# EAGLE design Me-RJ11 Adapter v2.0 (EAGLE 6.2)
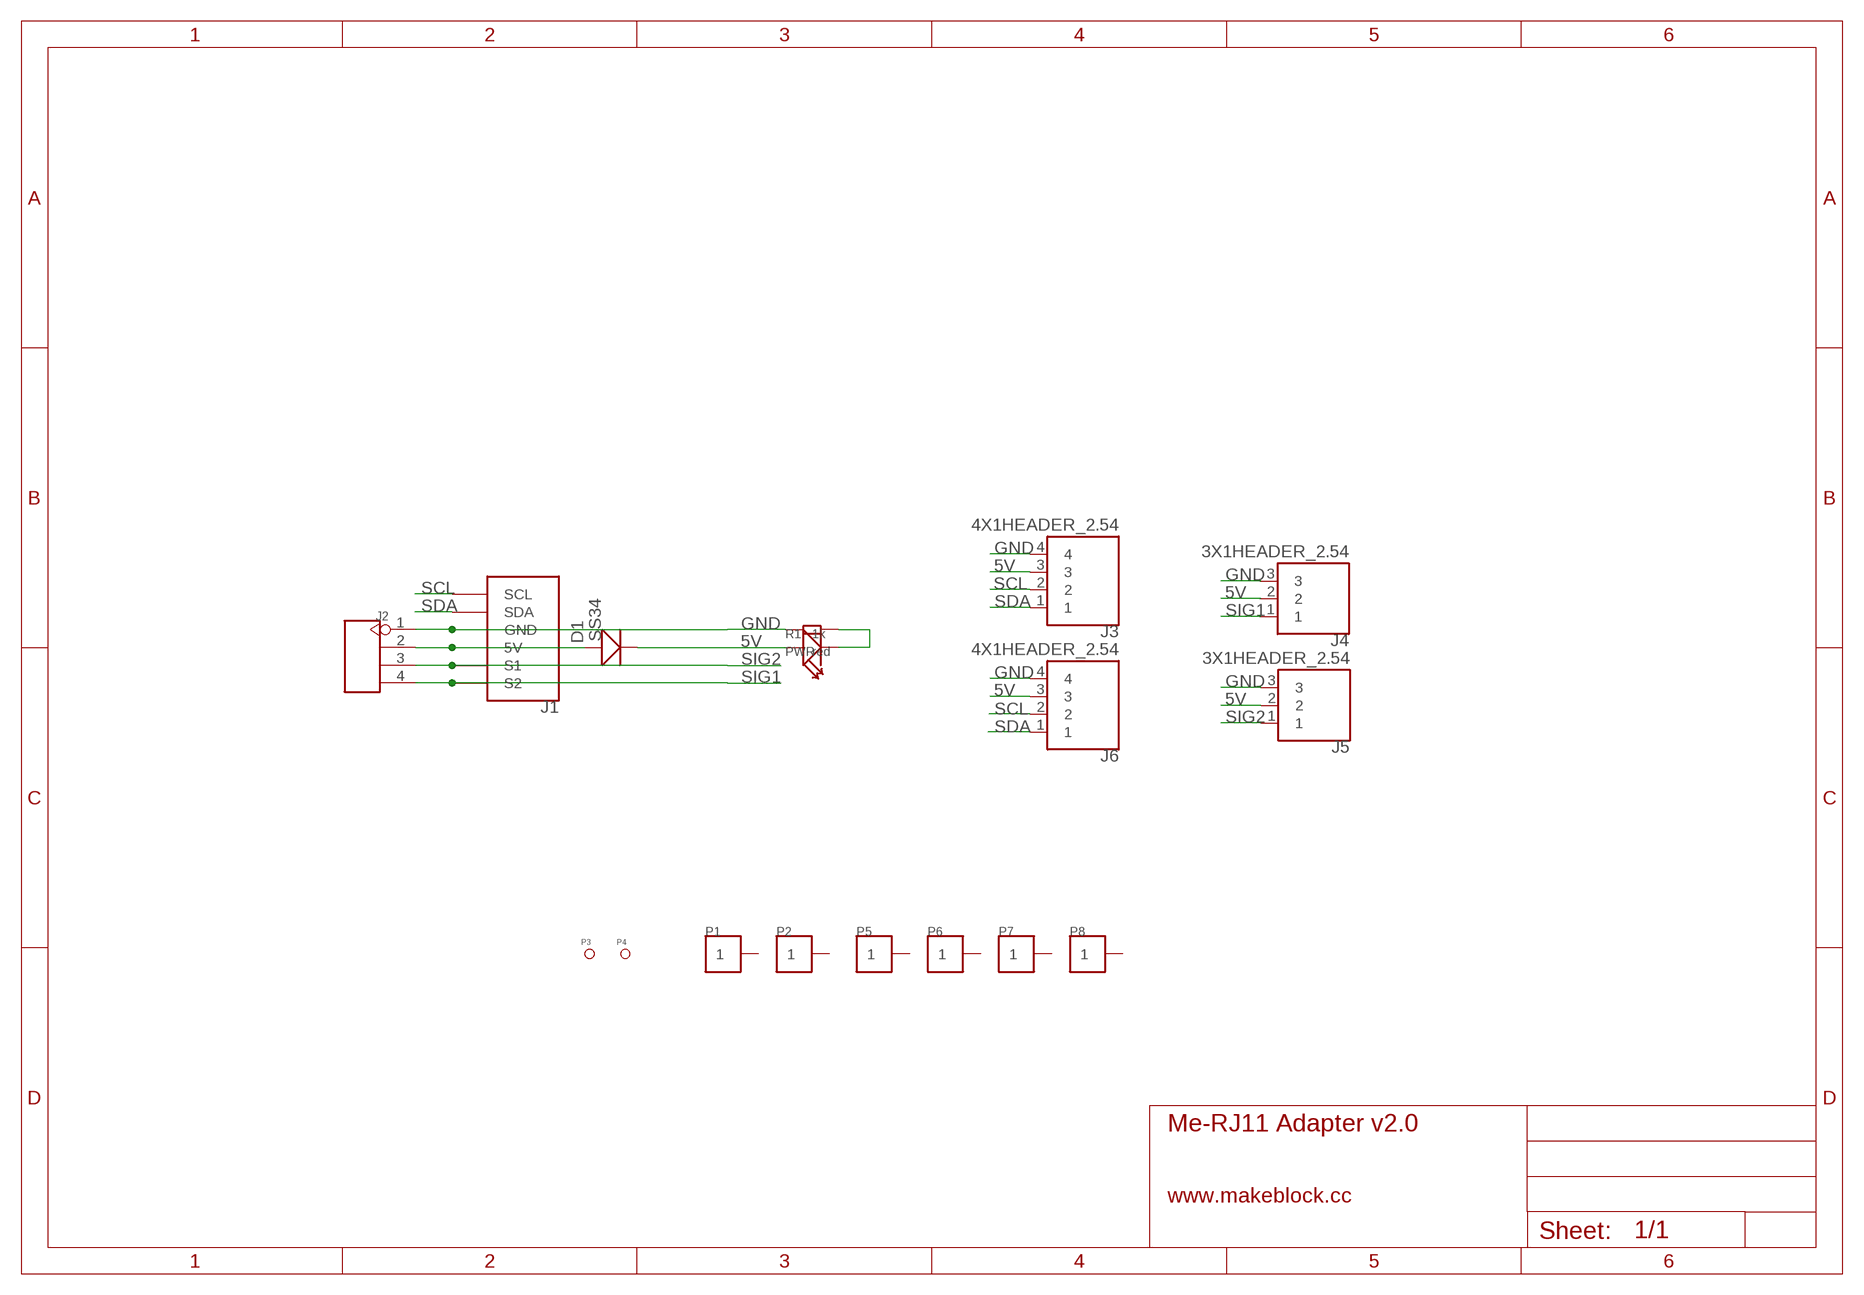
[diagram p0: schematic, sheet 1]

## Parts
D1  SS34  D'SMA'  [D2010]
J1  RJ11-6P6C-DIGI  [RJ11-6P6C]
J2  HEADER-4P-60/35MIL  [4P-65/35MIL]
J3  4X1HEADER_2.54  [4X1HEADER_2.54]
J4  3X1HEADER_2.54  [3X1HEADER_2.54]
J5  3X1HEADER_2.54  [3X1HEADER_2.54]
J6  4X1HEADER_2.54  [4X1HEADER_2.54]
P1  PAD-1P-4MM  [HOLE-01]
P2  PAD-1P-4MM  [HOLE-01]
P3  PAD-MARK  [ROUND-MARK-1.0]
P4  PAD-MARK  [ROUND-MARK-1.0]
P5  PAD-1P-4MM  [HOLE-01]
P6  PAD-1P-4MM  [HOLE-01]
P7  PAD-1P-4MM  [HOLE-01]
P8  PAD-1P-4MM  [HOLE-01]
PWR  red  LED'0603'  [LED-0603]
R1  1k  R-0603  [0603]

## Nets
5V: D1.- J3.3 J4.2 J5.2 J6.3 PWR.+
GND: J1.3(GND) J2.1 J3.4 J4.3 J5.3 J6.4 R1.1
N$1: PWR.- R1.2
N$2: D1.+ J1.4(5V) J2.2
SCL: J1.1(SCL) J3.2 J6.2
SDA: J1.2(SDA) J3.1 J6.1
SIG1: J1.6(S2) J2.4 J4.1
SIG2: J1.5(S1) J2.3 J5.1
Unconnected: P1.1 P2.1 P5.1 P6.1 P7.1 P8.1

## Notes on the sheet
- www.makeblock.cc

## Library data of the parts
D1 = Discrete:D*
J1 = Makeblock:RJ11-6P6C-DIGI
J2 = Connector:HEADER-4P
J3 J6 = Makeblock:4X1HEADER_2.54
J4 J5 = Makeblock:3X1HEADER_2.54
P1 P2 P5-P8 = Makeblock:PAD-1P*
P3 P4 = Discrete:PAD-MARK; PARTNO: DNP
PWR = Discrete:LED*
R1 = Discrete:R*

## Board
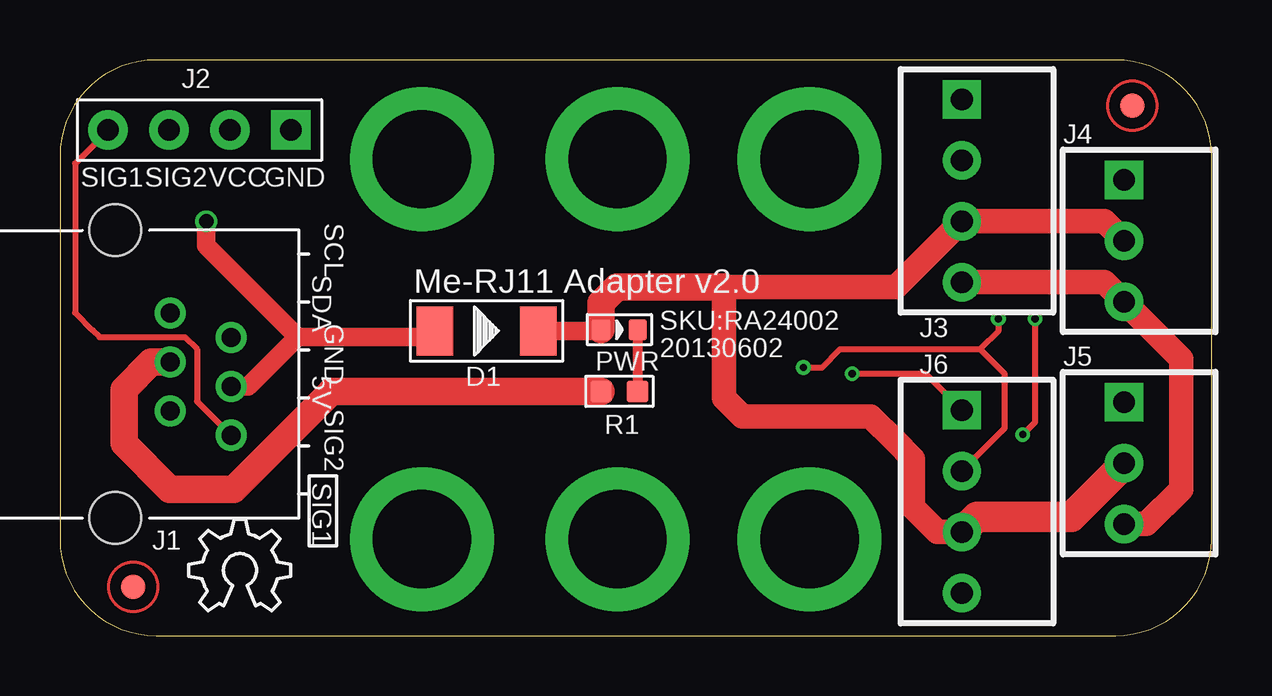
[diagram p1: board, top side]
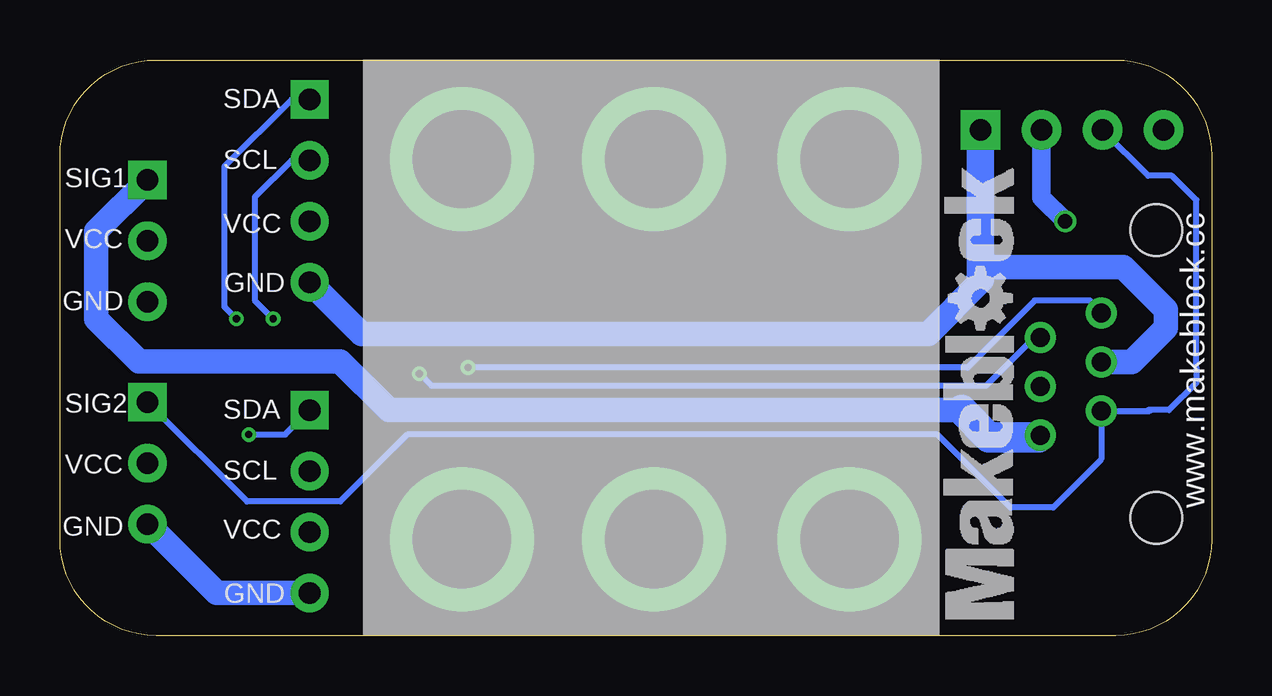
[diagram p2: board, bottom side, seen from below]

Size 48 x 24 mm. Coordinates in mm from the lower left corner, seen from the top.
Outline: 0,20 0,4 arc90 4,0 44,0 arc90 48,4 48,20 arc90 44,24 4,24 arc90 0,20
Copper layers (1*16): Top 0.035mm / dielectric 1.5mm / Bottom 0.035mm
Design rules: minimum track width 6mil, minimum drill 12mil, track to track 8mil, track to pad 8mil, pad to pad 8mil, via to via 8mil, smd to smd 0mil, copper to edge 10mil, drill to drill 10mil, minimum pad ring 10mil, minimum via ring 6mil, stop-mask expansion 2mil, vias tented up to drill 100mil, thermal gap 10mil

### Footprints (pad centres in the part's own frame; a part is rotated, then mirrored left to right if it is on the bottom)
D2010 = smd 1.524 x 2.032: + -2.159,0; - 2.159,0
RJ11-6P6C = drill 0.8: 1 -2.55,1.8; 2 -1.53,4.34; 3 -0.51,1.8; 4 0.51,4.34; 5 1.53,1.8; 6 2.55,4.34 | hole 2.15: -6,-0.5; 6,-0.5
4P-65/35MIL = drill 0.889 pad 1.651 square: 1 0,3.81 | drill 0.889 pad 1.651: 2 0,1.27; 3 0,-1.27; 4 0,-3.81
4X1HEADER_2.54 = drill 0.9 pad 1.6 square: 1 0,0 | drill 0.9 pad 1.6: 2 0,-2.54; 3 0,-5.08; 4 0,-7.62
3X1HEADER_2.54 = drill 0.9 pad 1.6 square: 1 0,2.54 | drill 0.9 pad 1.6: 2 0,0; 3 0,-2.54
HOLE-01 = drill 4.1 pad 6: 1 0,0
ROUND-MARK-1.0 = smd 1.016 x 1.016: P$1 0,0
LED-0603 = smd 0.762 x 0.889: + -0.762,0; - 0.762,0
0603 = smd 0.889 x 0.889: 1 -0.762,0; 2 0.762,0

### Placement (x,y rotation side)
D1  17.78,12.7 0 top
J1  2.79,10.9 270 top
J2  5.82,21.08 270 top
J3  37.59,22.35 0 top
J4  44.35,16.46 0 top
J5  44.35,7.19 0 top
J6  37.59,9.4 0 top
P1  31.24,19.86 0 top
P2  23.24,19.86 0 top
P3  3.05,2.03 0 top
P4  44.7,22.1 0 top
P5  23.24,4.01 0 top
P6  15.09,4.01 0 top
P7  15.09,19.86 0 top
P8  31.24,4.01 0 top
PWR  23.32,12.75 0 top
R1  23.32,10.19 0 top
U$1  [LOGO-3/2]  8.24,0.67 90 bottom
U$2  [OSHW_6X150_NOTEXT]  5.37,1.04 0 top

### Tracks (layer width: path | path; a pad name or v marks a point on that pad's centre or on a via)
5V
  Top 0.762: D1.- 22.5,12.7 PWR.+
  Top 1.016: J4.2 43.54,17.27 J3.3 34.85,14.53 27.69,14.53 27.69,9.91 28.45,9.14 33.78,9.14 34.8,8.13 35.56,7.37 35.56,5.33 35.81,5.08 36.07,4.83 36.58,4.32 J6.3
  Top 1.143: PWR.+ 22.55,13.87 23.22,14.53 27.69,14.53
  Top 1.27: J5.2 44.35,7.14 42.16,4.95 38.23,4.95 J6.3
GND
  Top 0.406: 11.3,10.19 11.28,10.21 10.89,10.21
  Top 1.016: J3.4 43.54,14.73 J4.3 46.74,11.53 46.74,6.1 45.29,4.65 J5.3
  Top 1.143: R1.1 19.41,10.19 11.3,10.19 11.3,10.16 8.64,7.49 7.24,6.1 4.57,6.1 2.67,8 2.67,9.48 2.67,10.26 3.81,11.41 J1.3
  Bottom 1.016: 9.63,14.85 9.63,14.76 11.81,12.57 35.43,12.57 J3.4 | J6.4 41.48,1.78 J5.3 | J1.3 3.33,11.41 1.91,12.83 1.91,13.59 3.68,15.37 9.5,15.37 9.63,15.24
  Bottom 1.143: J2.1 9.63,15.24 9.63,14.85
N$1
  Top 0.406: PWR.- R1.2
N$2  (via drill 0.6)
  Top 0.762: v6.1,17.27 6.1,16.26 9.91,12.45 | 9.91,12.45 15.37,12.45 D1.+ | J1.4 7.85,10.39 9.91,12.45
  Bottom 0.762: J2.2 7.09,18.26 v6.1,17.27
SCL  (via drill 0.3 pad 0.61)
  Top 0.254: v30.99,11.18 31.75,11.18 32.51,11.94 38.35,11.94 | 38.35,11.94 39.37,10.92 39.37,8.64 J6.2 | v39.12,13.21 39.12,12.7 38.35,11.94
  Bottom 0.254: J1.1 4.59,13.48 5.08,13.97 7.37,13.97 9.91,11.43 10.16,11.18 v30.99,11.18 | J3.2 38.35,19.81 39.88,18.29 39.88,13.97 v39.12,13.21
SDA  (via drill 0.3 pad 0.61)
  Top 0.254: v33.02,10.92 36.07,10.92 J6.1 | v40.64,13.21 40.64,8.89 v40.13,8.38
  Bottom 0.254: v33.02,10.92 32.51,10.41 9.4,10.41 7.37,12.45 7.15,12.45 J1.2 | J3.1 38.35,22.35 41.15,19.56 41.15,13.72 v40.64,13.21 | v40.13,8.38 38.61,8.38 J6.1
SIG1
  Top 0.254: J1.6 5.71,9.77 5.71,11.94 5.21,12.45 1.65,12.45 1.37,12.72 0.64,13.46 0.64,19.68 0.76,19.81 2.01,21.06
  Top 0.406: J2.4 2.01,21.06
  Bottom 1.016: 10.41,9.4 34.29,9.4 36.32,11.43 44.7,11.43 46.48,13.21 46.48,16.87 J4.1
  Bottom 1.27: 10.41,9.4 9.27,8.26 7.23,8.26 J1.6
SIG2
  Bottom 0.254: 2.67,9.37 J1.5 4.59,7.34 6.6,5.33 8.38,5.33 11.43,8.38 33.53,8.38 36.32,5.59 40.21,5.59 J5.1 | 2.67,9.37 2.57,9.37 | J2.3 2.64,19.18 1.65,19.18 0.64,18.16 0.64,11.18 0.64,10.54 1.78,9.4 2.64,9.4 2.67,9.37

### Text on the board
tPlace: SIG1 | SIG2 | VCC | GND | SCL | SDA | Me-RJ11 Adapter v2.0 | GND | SKU:RA24002 | 20130602 | 5V | SIG2 | SIG1
bPlace: SDA | SCL | SIG1 | www.makeblock.cc | VCC | VCC | GND | GND | SDA | SIG2 | SCL | VCC | VCC | GND | GND